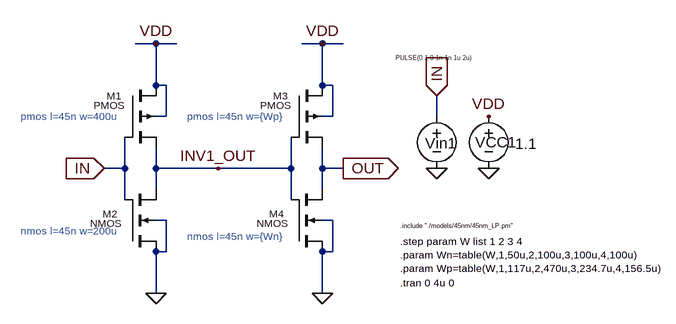
[diagram p0: schematic CMOS Double Inverter - Transient.asc]
CMOS Double Inverter - Transient.asc, the LTspice schematic file:
Version 4
SHEET 1 880 680
WIRE -352 -32 -384 -32
WIRE -320 -32 -352 -32
WIRE -96 -32 -128 -32
WIRE -64 -32 -96 -32
WIRE -352 32 -352 -32
WIRE -336 32 -352 32
WIRE -96 32 -96 -32
WIRE -80 32 -96 32
WIRE -336 80 -336 32
WIRE -336 80 -352 80
WIRE -80 80 -80 32
WIRE -80 80 -96 80
WIRE 80 80 80 48
WIRE -400 160 -400 112
WIRE -400 160 -432 160
WIRE -352 160 -352 128
WIRE -256 160 -352 160
WIRE -144 160 -144 112
WIRE -144 160 -256 160
WIRE -96 160 -96 128
WIRE -64 160 -96 160
WIRE -352 192 -352 160
WIRE -96 192 -96 160
WIRE -400 208 -400 160
WIRE -144 208 -144 160
WIRE -336 240 -352 240
WIRE -80 240 -96 240
WIRE -336 288 -336 240
WIRE -336 288 -352 288
WIRE -80 288 -80 240
WIRE -80 288 -96 288
WIRE -352 352 -352 288
WIRE -96 352 -96 288
FLAG -352 -32 VDD
FLAG -352 352 0
FLAG -432 160 IN
IOPIN -432 160 In
FLAG 160 80 VDD
FLAG 160 160 0
FLAG 80 160 0
FLAG 80 48 IN
IOPIN 80 48 In
FLAG -96 -32 VDD
FLAG -96 352 0
FLAG -64 160 OUT
IOPIN -64 160 Out
FLAG -256 160 INV1_OUT
SYMBOL nmos4 -400 288 M180
WINDOW 0 -34 58 Left 1
WINDOW 3 -53 44 Left 1
SYMATTR InstName M2
SYMATTR Value2 l=45n w=200u
SYMBOL pmos4 -400 32 R0
WINDOW 0 -28 16 Left 1
WINDOW 3 -48 31 Left 1
SYMATTR InstName M1
SYMATTR Value2 l=45n w=400u
SYMBOL voltage 160 64 R0
WINDOW 123 0 0 Left 0
WINDOW 39 0 0 Left 0
WINDOW 0 -21 56 Left 2
WINDOW 3 41 58 Left 2
SYMATTR InstName VCC1
SYMATTR Value 1.1
SYMBOL voltage 80 64 R0
WINDOW 123 0 0 Left 0
WINDOW 39 0 0 Left 0
WINDOW 0 -18 57 Left 2
WINDOW 3 -63 -74 Left 0
SYMATTR InstName Vin1
SYMATTR Value PULSE(0 1 0 1n 1n 1u 2u)
SYMBOL nmos4 -144 288 M180
WINDOW 0 -34 58 Left 1
WINDOW 3 -53 44 Left 1
SYMATTR InstName M4
SYMATTR Value2 l=45n w={Wn}
SYMBOL pmos4 -144 32 R0
WINDOW 0 -28 16 Left 1
WINDOW 3 -48 31 Left 1
SYMATTR InstName M3
SYMATTR Value2 l=45n w={Wp}
TEXT 24 248 Left 0 !.include "./models/45nm/45nm_LP.pm"
TEXT 24 336 Left 1 !.tran 0 4u 0
TEXT 24 272 Left 1 !.step param W list 1 2 3 4\n.param Wn=table(W,1,50u,2,100u,3,100u,4,100u)\n.param Wp=table(W,1,117u,2,470u,3,234.7u,4,156.5u)
TEXT -560 80 Left 1 ;pmos l=45n w=400u
TEXT -560 256 Left 1 ;nmos l=45n w=200u
TEXT -304 80 Left 1 ;pmos l=45n w={Wp}
TEXT -304 264 Left 1 ;nmos l=45n w={Wn}

The netlist it stands for:
* CMOS Double Inverter - Transient.asc
M2 0 IN INV1_OUT 0 NMOS l=45n w=200u
M1 VDD IN INV1_OUT VDD PMOS l=45n w=400u
VCC1 VDD 0 1.1
Vin1 IN 0 PULSE(0 1 0 1n 1n 1u 2u)
M4 0 INV1_OUT OUT 0 NMOS l=45n w={Wn}
M3 VDD INV1_OUT OUT VDD PMOS l=45n w={Wp}
.model NMOS NMOS
.model PMOS PMOS
.lib standard.mos
.include "./models/45nm/45nm_LP.pm"
.tran 0 4u 0
.step param W list 1 2 3 4
.param Wn=table(W,1,50u,2,100u,3,100u,4,100u)
.param Wp=table(W,1,117u,2,470u,3,234.7u,4,156.5u)
* pmos l=45n w=400u
* nmos l=45n w=200u
* pmos l=45n w={Wp}
* nmos l=45n w={Wn}
.backanno
.end